# EAGLE design FotoCell (EAGLE 5.06)
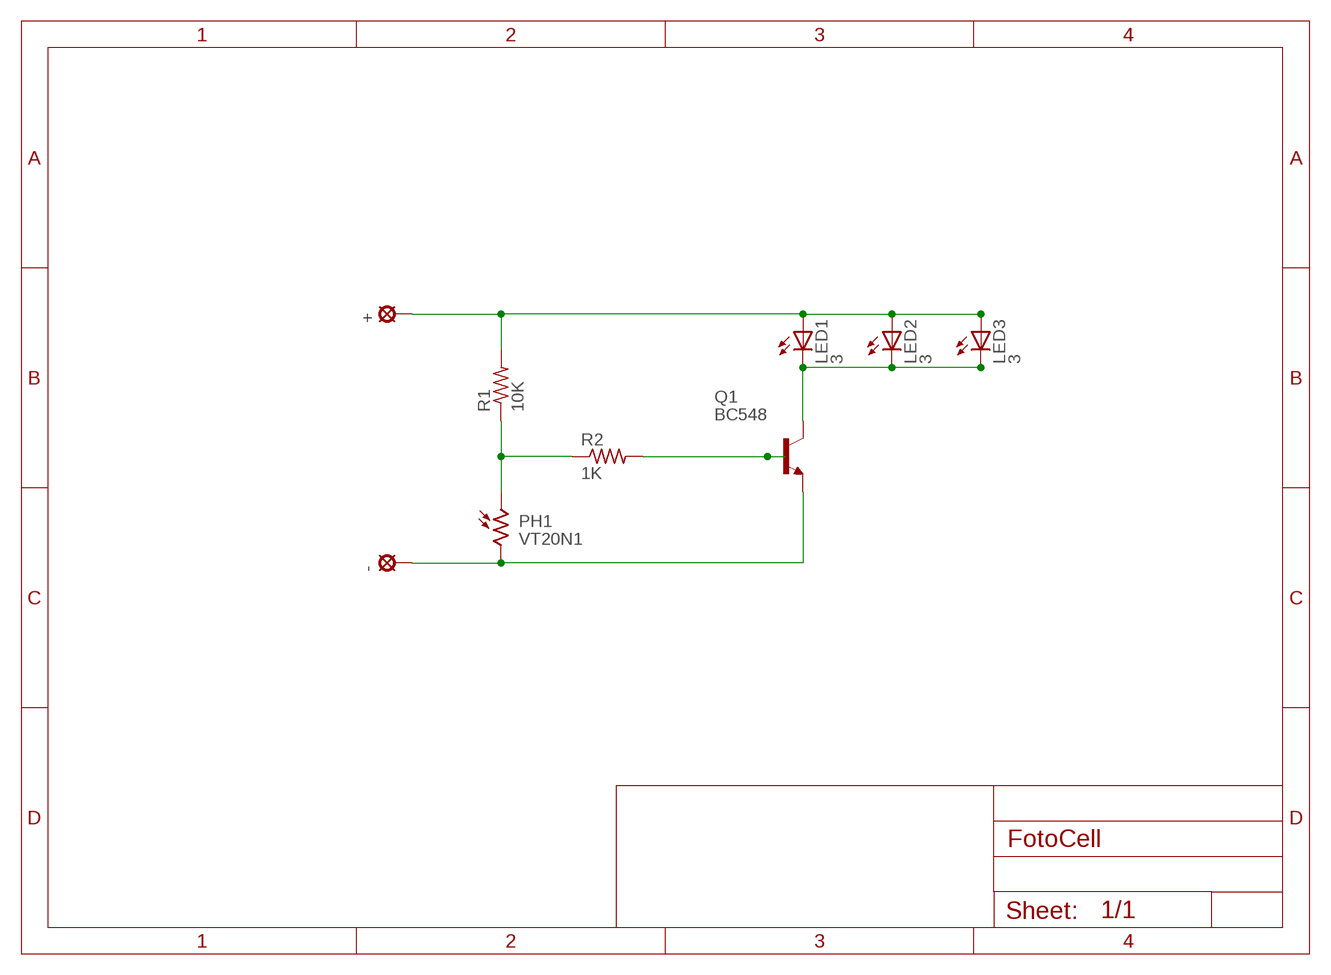
[diagram p0: schematic, sheet 1]

## Parts
+  LSP10  [LSP10]
-  LSP10  [LSP10]
LED1  3  LED5MM  [LED5MM]
LED2  3  LED5MM  [LED5MM]
LED3  3  LED5MM  [LED5MM]
PH1  VT20N1  [TO46-VT200]
Q1  BC548  [TO92-EBC]
R1  10K  R-US_0204/5  [0204/5]
R2  1K  R-US_0204/5  [0204/5]

## Nets
N$1: PH1.1 R1.1 R2.1
N$2: Q1.B R2.2
N$3: -.MP PH1.2 Q1.E
N$4: LED1.K(C) LED2.K(C) LED3.K(C) Q1.C
N$5: +.MP LED1.A LED2.A LED3.A R1.2

## Library data of the parts
+ - = solpad:LSP10: SOLDER PAD drill 1.0 mm, distributor Buerklin, 12H555
LED1-LED3 = led:LED: LED OSRAM: - CHIPLED LG R971, LG N971, LY N971, LG Q971, LY Q971, LO R971, LY R971 LH N974, LH R974 LS Q976, LO Q976, LY Q976 LO Q996 - Hyper CHIPLED LW Q18S LB Q993, LB Q99A, LB R99A - SideLED LS A670, LO A670, LY A670, LG A670, LP A670 LB A673, LV A673, LT A673, LW A673 LH A674 LY A675 LS A676, LA A676, LO A676, LY A676, LW A676 LS A679, LY A679, LG A679 - Hyper Micro SIDELED® LS Y876, LA Y876, LO Y876, LY Y876 LT Y87S - SmartLED LW L88C, LW L88S LB L89C, LB L89S, LG L890 LS L89K, LO L89K, LY L89K LS L896, LA L896, LO L896, LY L896 - TOPLED LS T670, LO T670, LY T670, LG T670, LP T670 LSG T670, LSP T670, LSY T670, LOP T670, LYG T670 LG T671, LOG T671, LSG T671 LB T673, LV T673, LT T673, LW T673 LH T674 LS T676, LA T676, LO T676, LY T676, LB T676, LH T676, LSB T676, LW T676 LB T67C, LV T67C, LT T67C, LS T67K, LO T67K, LY T67K, LW E67C LS E67B, LA E67B, LO E67B, LY E67B, LB E67C, LV E67C, LT E67C LW T67C LS T679, LY T679, LG T679 LS T770, LO T770, LY T770, LG T770, LP T770 LB T773, LV T773, LT T773, LW T773 LH T774 LS E675, LA E675, LY E675, LS T675 LS T776, LA T776, LO T776, LY T776, LB T776 LHGB T686 LT T68C, LB T68C - Hyper Mini TOPLED® LB M676 - Mini TOPLED Santana® LG M470 LS M47K, LO M47K, LY M47K Source: http://www.osram.convergy.de LUXEON: - LUMILED® LXK2-PW12-R00, LXK2-PW12-S00, LXK2-PW14-U00, LXK2-PW14-V00 LXK2-PM12-R00, LXK2-PM12-S00, LXK2-PM14-U00 LXK2-PE12-Q00, LXK2-PE12-R00, LXK2-PE12-S00, LXK2-PE14-T00, LXK2-PE14-U00 LXK2-PB12-K00, LXK2-PB12-L00, LXK2-PB12-M00, LXK2-PB14-N00, LXK2-PB14-P00, LXK2-PB14-Q00 LXK2-PR12-L00, LXK2-PR12-M00, LXK2-PR14-Q00, LXK2-PR14-R00 LXK2-PD12-Q00, LXK2-PD12-R00, LXK2-PD12-S00 LXK2-PH12-R00, LXK2-PH12-S00 LXK2-PL12-P00, LXK2-PL12-Q00, LXK2-PL12-R00 Source: www.luxeon.com KINGBRIGHT: KA-3528ASYC Source: www.kingbright.com
PH1 = photo-elements:VT2*: Photoconductive Cell VT200 Series Source: http://optoelectronics.perkinelmer.com/content/Datasheets/DTS_vt200seriesdatasheet.pdf
Q1 = transistor-npn:BC548*: NPN Transistor
R1 R2 = rcl:R-US_: RESISTOR, American symbol

## Board
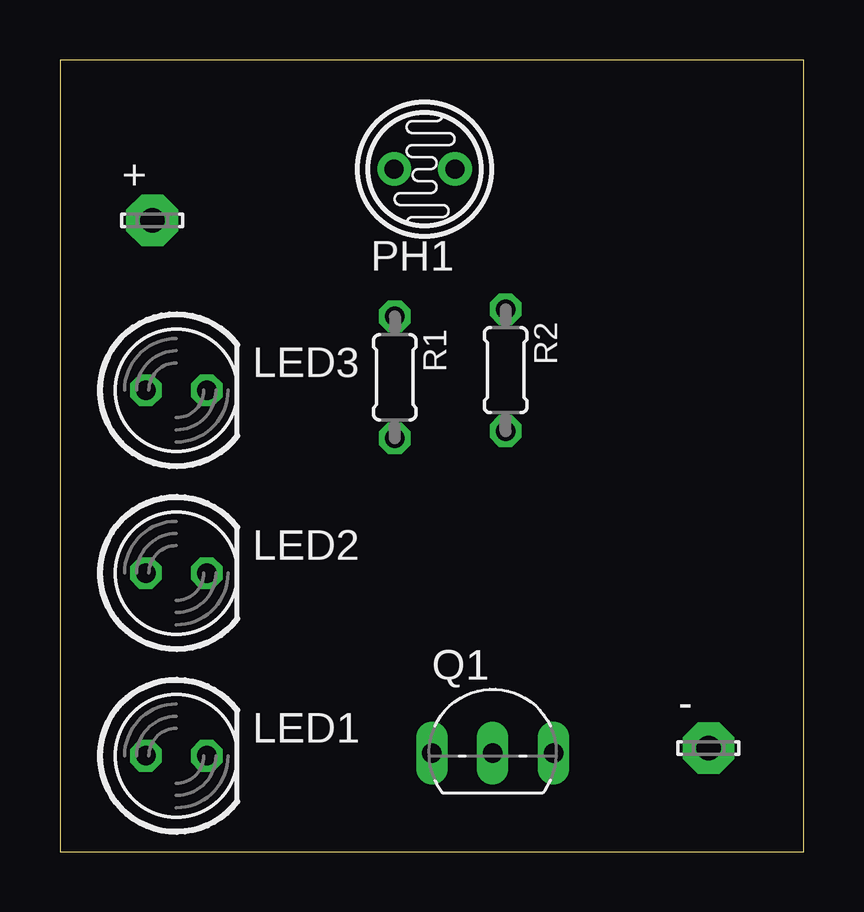
[diagram p1: board, top side]
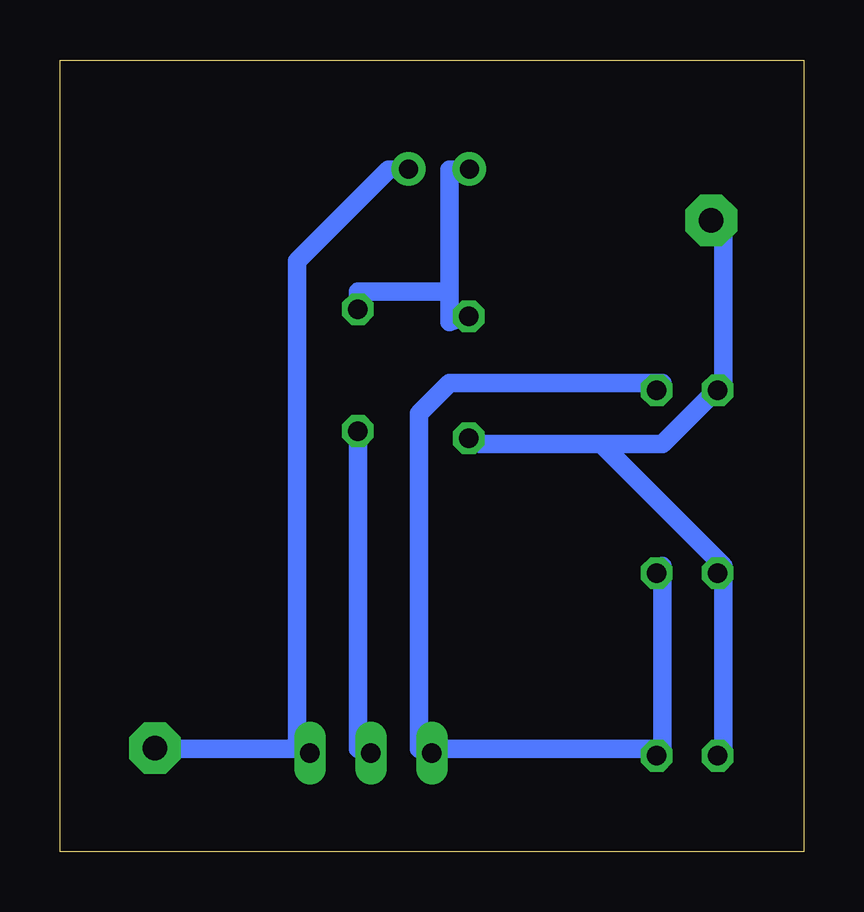
[diagram p2: board, bottom side, seen from below]

Size 31 x 33 mm. Coordinates in mm from the lower left corner, seen from the top.
Outline: 0,0 31,0 31,33 0,33 0,0
Copper layers (1*16): Top 0.035mm / dielectric 1.5mm / Bottom 0.035mm
Design rules "default *": minimum track width 30mil, minimum drill 24mil, track to track 8mil, track to pad 8mil, pad to pad 8mil, via to via 8mil, smd to smd 8mil, copper to edge 40mil, drill to drill 8mil, minimum pad ring 10mil, minimum via ring 8mil, stop-mask expansion 4mil, vias tented up to drill 0mil, thermal gap 10mil

### Footprints (pad centres in the part's own frame; a part is rotated, then mirrored left to right if it is on the bottom)
LSP10 = drill 1.016 pad 2.159 octagon: MP 0,0
LED5MM = drill 0.813 octagon: A -1.27,0; K 1.27,0
TO46-VT200 = drill 0.8 pad 1.4 round: 1 -1.27,0; 2 1.27,0
TO92-EBC = drill 0.813 long: B 0,-1.27; C -2.54,-1.27; E 2.54,-1.27
0204/5 = drill 0.813 octagon: 1 -2.54,0; 2 2.54,0

### Placement (x,y rotation side)
+  3.85,26.31 0 top
-  27.04,4.31 0 top
LED1  4.85,3.99 0 top
LED2  4.85,11.61 0 top
LED3  4.85,19.23 0 top
PH1  15.2,28.45 0 top
Q1  18.04,5.37 0 top
R1  13.96,19.77 270 top
R2  18.58,20.07 270 top

### Tracks (layer width: path | path; a pad name or v marks a point on that pad's centre or on a via)
N$1
  Bottom 0.762: 14.77,23.34 14.77,22.07 R1.1 | 14.77,23.34 14.77,28.42 PH1.1 | 14.77,23.34 18.58,23.34 R2.1
N$2
  Bottom 0.762: Q1.B 18.58,4.29 R2.2
N$3
  Bottom 0.762: 21.12,4.29 21.12,24.61 17.31,28.42 PH1.2 | 21.12,4.29 26.2,4.29 -.MP | Q1.E 21.12,4.29
N$4
  Bottom 0.762: 5.88,4.29 5.88,11.91 LED2.K | LED3.K 5.88,19.53 14.77,19.53 16.04,18.26 16.04,4.29 Q1.C 14.77,4.29 5.88,4.29 | LED1.K 5.88,4.29
N$5
  Bottom 0.762: 3.34,11.91 3.34,4.29 LED1.A | 8.42,16.99 5.88,16.99 3.34,19.53 | 8.42,16.99 13.5,16.99 R1.2 | 3.34,19.53 3.34,25.88 +.MP | 3.34,19.53 LED3.A | 3.34,11.91 8.42,16.99 | 3.34,11.91 LED2.A